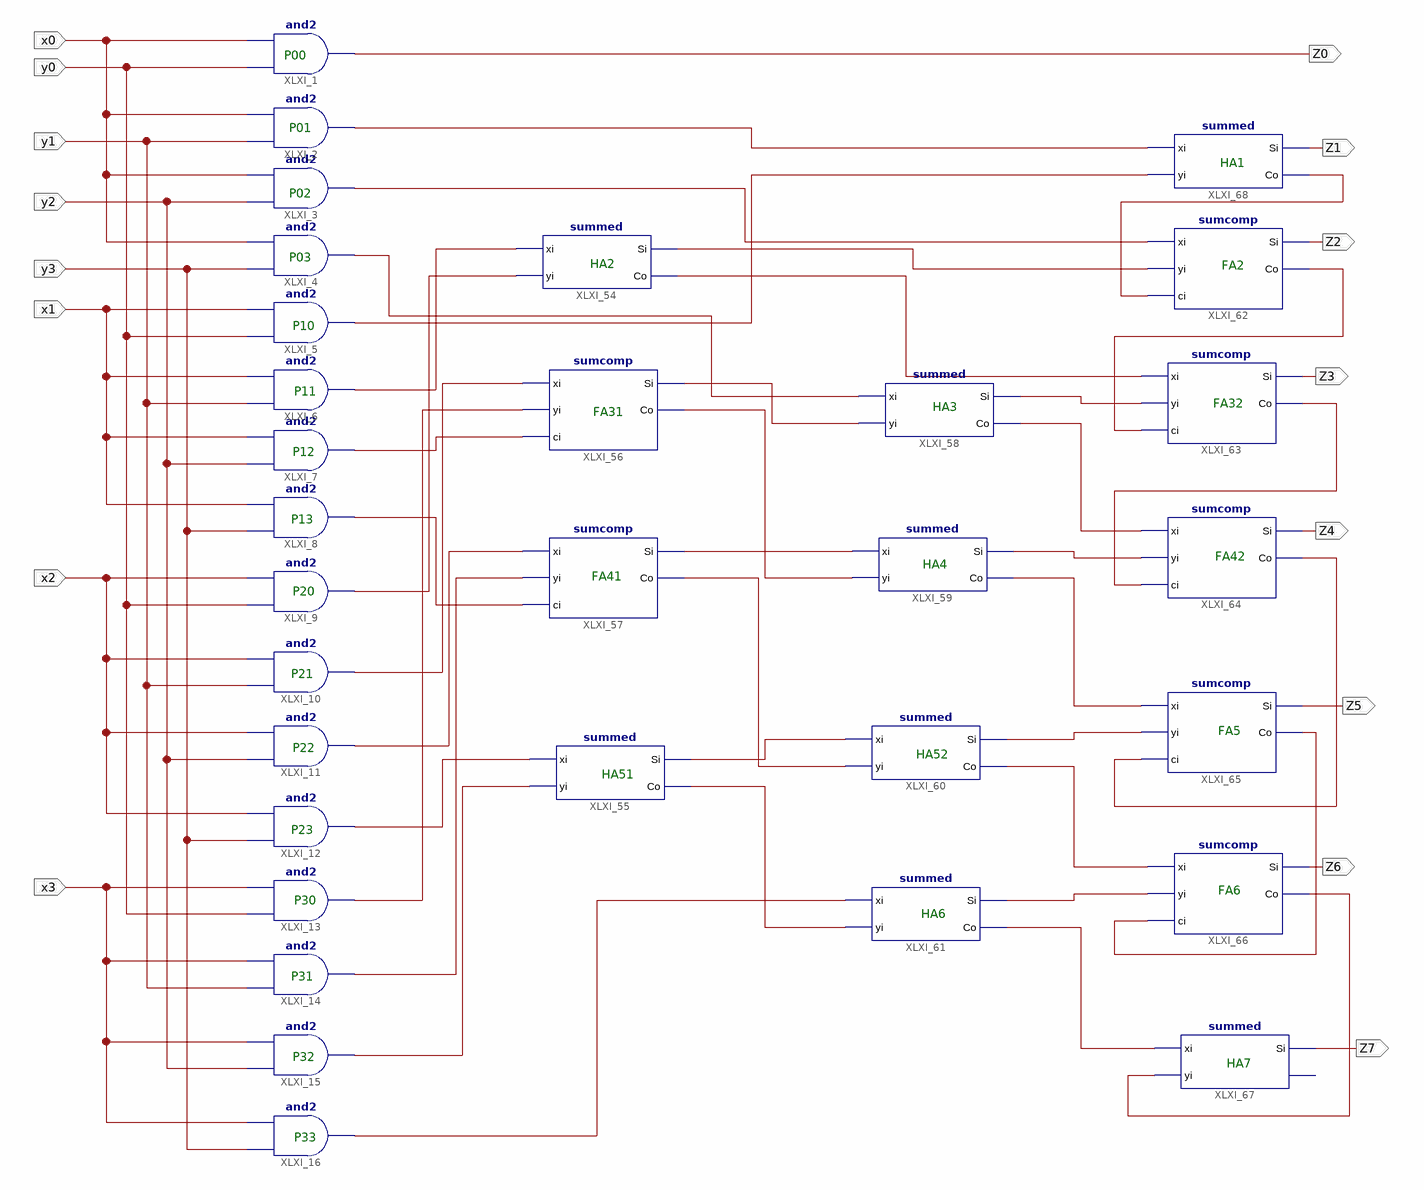
[diagram p0: schematic sheet 1]
// Xilinx ISE schematic multiplicador_4b.sch (spartan6) as structural Verilog: 31 symbols, 16 ports
module multiplicador_4b (
  input  x0,
  input  x1,
  input  x2,
  input  x3,
  input  y0,
  input  y1,
  input  y2,
  input  y3,
  output Z0,
  output Z1,
  output Z2,
  output Z3,
  output Z4,
  output Z5,
  output Z6,
  output Z7
);

  wire XLXN_199, XLXN_200, XLXN_201, XLXN_202, XLXN_203, XLXN_204, XLXN_205, XLXN_206, XLXN_207, XLXN_208,
       XLXN_209, XLXN_210, XLXN_211, XLXN_212, XLXN_213, XLXN_214, XLXN_215, XLXN_216, XLXN_218, XLXN_219,
       XLXN_220, XLXN_221, XLXN_222, XLXN_223, XLXN_224, XLXN_225, XLXN_226, XLXN_227, XLXN_228, XLXN_229,
       XLXN_230, XLXN_231, XLXN_232, XLXN_233, XLXN_234, XLXN_235, XLXN_236;

  and XLXI_1 (Z0, y0, x0);
  and XLXI_2 (XLXN_199, y1, x0);
  and XLXI_3 (XLXN_221, y2, x0);
  and XLXI_4 (XLXN_211, y3, x0);
  and XLXI_6 (XLXN_201, y1, x1);
  and XLXI_7 (XLXN_204, y2, x1);
  and XLXI_8 (XLXN_208, y3, x1);
  and XLXI_5 (XLXN_200, y0, x1);
  and XLXI_9 (XLXN_202, y0, x2);
  and XLXI_10 (XLXN_203, y1, x2);
  and XLXI_11 (XLXN_206, y2, x2);
  and XLXI_12 (XLXN_209, y3, x2);
  and XLXI_13 (XLXN_205, y0, x3);
  and XLXI_14 (XLXN_207, y1, x3);
  and XLXI_15 (XLXN_210, y2, x3);
  and XLXI_16 (XLXN_219, y3, x3);
  summed XLXI_54 (.xi(XLXN_201), .yi(XLXN_202), .Si(XLXN_220), .Co(XLXN_223));
  summed XLXI_55 (.xi(XLXN_209), .yi(XLXN_210), .Si(XLXN_215), .Co(XLXN_218));
  sumcomp XLXI_56 (.ci(XLXN_204), .Co(XLXN_214), .Si(XLXN_212), .xi(XLXN_203), .yi(XLXN_205));
  sumcomp XLXI_57 (.ci(XLXN_208), .Co(XLXN_216), .Si(XLXN_213), .xi(XLXN_206), .yi(XLXN_207));
  summed XLXI_58 (.xi(XLXN_211), .yi(XLXN_212), .Si(XLXN_225), .Co(XLXN_227));
  summed XLXI_59 (.xi(XLXN_213), .yi(XLXN_214), .Si(XLXN_228), .Co(XLXN_230));
  summed XLXI_60 (.xi(XLXN_215), .yi(XLXN_216), .Si(XLXN_231), .Co(XLXN_232));
  summed XLXI_61 (.xi(XLXN_219), .yi(XLXN_218), .Si(XLXN_233), .Co(XLXN_235));
  sumcomp XLXI_62 (.ci(XLXN_222), .Co(XLXN_224), .Si(Z2), .xi(XLXN_221), .yi(XLXN_220));
  sumcomp XLXI_63 (.ci(XLXN_224), .Co(XLXN_226), .Si(Z3), .xi(XLXN_223), .yi(XLXN_225));
  sumcomp XLXI_64 (.ci(XLXN_226), .Co(XLXN_229), .Si(Z4), .xi(XLXN_227), .yi(XLXN_228));
  sumcomp XLXI_65 (.ci(XLXN_229), .Co(XLXN_234), .Si(Z5), .xi(XLXN_230), .yi(XLXN_231));
  sumcomp XLXI_66 (.ci(XLXN_234), .Co(XLXN_236), .Si(Z6), .xi(XLXN_232), .yi(XLXN_233));
  summed XLXI_67 (.xi(XLXN_235), .yi(XLXN_236), .Si(Z7));  // open: Co
  summed XLXI_68 (.xi(XLXN_199), .yi(XLXN_200), .Si(Z1), .Co(XLXN_222));

  // Notes on the sheet:
  //   P00
  //   P01
  //   HA1
  //   P02
  //   P03
  //   HA2
  //   FA2
  //   P10
  //   P11
  //   FA32
  //   HA3
  //   FA31
  //   P12
  //   P13
  //   FA42
  //   HA4
  //   FA41
  //   P20
  //   P21
  //   FA5
  //   P22
  //   HA52
  //   HA51
  //   P23
  //   FA6
  //   P30
  //   HA6
  //   P31
  //   P32
  //   HA7
  //   P33
endmodule
